# EAGLE design badge_03v5 (EAGLE 8.3.2)
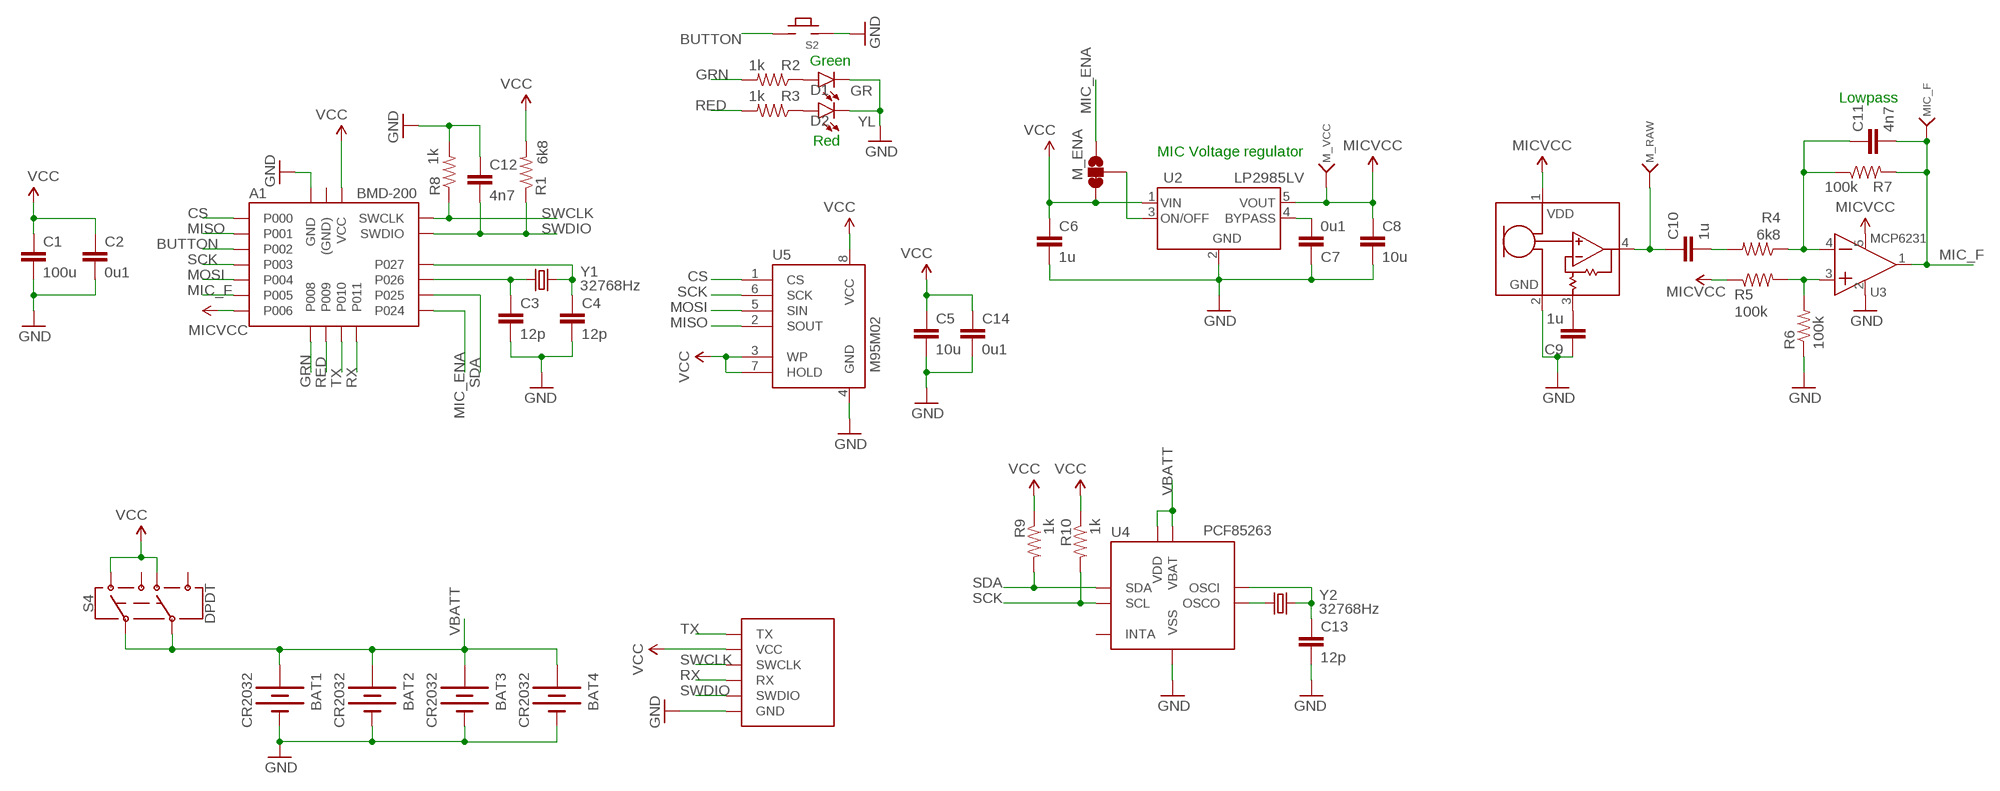
[diagram p0: schematic, sheet 1]

## Parts
A1  BMD-200  [BMD-200]
BAT1  CR2032  BATTERY20MM_ISO_NOCREAM  [BATTCON_20MM_4LEGS_ISO_NOCREAM]
BAT2  CR2032  BATTERY20MM_ISO_NOCREAM  [BATTCON_20MM_4LEGS_ISO_NOCREAM]
BAT3  CR2032  BATTERYHOLDER  [BU2032SM]
BAT4  CR2032  BATTERYBU2032SM_CREAM  [BU2032SM_CREAM]
C1  100u  C-EUC1206  [C1206]
C2  0u1  C-EUC0603  [C0603]
C3  12p  C-EUC0603  [C0603]
C4  12p  C-EUC0603  [C0603]
C5  10u  C-EUC0603  [C0603]
C6  1u  C-EUC0603  [C0603]
C7  0u1  C-EUC0603  [C0603]
C8  10u  C-EUC0603  [C0603]
C9  1u  C-EUC0603  [C0603]
C10  1u  C-EUC0603  [C0603]
C11  4n7  C-EUC0603  [C0603]
C12  4n7  C-EUC0603  [C0603]
C13  12p  C-EUC0603  [C0603]
C14  0u1  C-EUC0603  [C0603]
D1  GR  LED  [LED-0603]
D2  YL  LED  [LED-0603]
J1  PROG_CONN_6  [TH_CONN_6]
M_ENA  JUMPER-PAD-3-2OF3_NC_BY_TRACE_SMALL  [PAD-JUMPER-3-2OF3_NC_BY_TRACE_YES_SILK_FULL_BOX]
M_RAW  TESTPOINT  [TESTPOINT]
M_VCC  TESTPOINT  [TESTPOINT]
MIC_F  TESTPOINT  [TESTPOINT]
MK1  SPU0414  SPU0414(AMP)  [MIC_SPU041X]
R1  6k8  R-US_R0603  [R0603]
R2  1k  R-US_R0603  [R0603]
R3  1k  R-US_R0603  [R0603]
R4  6k8  R-US_R0603  [R0603]
R5  100k  R-US_R0603  [R0603]
R6  100k  R-US_R0603  [R0603]
R7  100k  R-US_R0603  [R0603]
R8  1k  R-US_R0603  [R0603]
R9  1k  R-US_R0603  [R0603]
R10  1k  R-US_R0603  [R0603]
S2  TACT6mm  TACT6MM4  [TACT1]
S4  DPDT  SWITCH-DPDT-SMD-AYZ0202  [SWITCH_DPDT_SMD_AYZ0202]
U2  LP2985LV  [SOT23-5L]
U3  MCP6231  [SOT23-5L]
U4  PCF85263  [SOIC8]
U5  M95M02  M95M02_SOIC  [SOIC8]
Y1  32768Hz  CRYSTAL  [CRYSTAL_2SMD]
Y2  32768Hz  CRYSTAL  [CRYSTAL_2SMD]

## Nets
BUTTON: A1.P$13(P002) S2.1 S2.2
CS: A1.P$11(P000) U5.1(CS)
GND: A1.P$1(GND) A1.P$2(GND) A1.P$3(GND) A1.P$4(GND) A1.P$7(GND) A1.P$10(GND) A1.P$19(GND) A1.P$26(GND) BAT1.NEG(-) BAT2.NEG(-) BAT3.- BAT4.- C1.2 C2.2 C3.2 C4.2 C5.2 C6.2 C7.1 C8.2 C9.1 C12.1 C13.2 C14.2 D1.C D2.C J1.GND MK1.2(GND) R6.1 R8.2 S2.3 S2.4 U2.2(GND) U3.2(GND) U4.4(VSS) U5.4(GND)
GRN: A1.P$20(P008) R2.2
MIC_ENA: A1.P$5(P024) M_ENA.1
MIC_F: A1.P$16(P005) C11.2 MIC_F.P$1(>NAME) R7.2 U3.1(O)
MICVCC: A1.P$17(P006) C8.1 M_VCC.P$1(>NAME) MK1.1(VDD) R5.1 U2.5(VOUT) U3.5(VDD)
MISO: A1.P$12(P001) U5.2(SOUT)
MOSI: A1.P$15(P004) U5.5(SIN)
N$1: U4.2(OSCO) Y2.P$2
N$2: A1.P$8(P026) C3.1 Y1.P$2
N$3: D1.A R2.1
N$4: D2.A R3.1
N$5: C13.1 U4.1(OSCI) Y2.P$1
N$6: M_ENA.2 U2.3(ON/OFF)
N$7: C9.2 MK1.3(GAIN)
N$8: A1.P$9(P027) C4.1 Y1.P$1
N$9: C7.2 U2.4(BYPASS)
N$10: R5.2 R6.2 U3.3(+)
N$11: C10.1 M_RAW.P$1(>NAME) MK1.4(OUT)
N$13: C10.2 R4.2
N$14: C11.1 R4.1 R7.1 U3.4(-)
RED: A1.P$21(P009) R3.2
RX: A1.P$23(P011) J1.RX
SCK: A1.P$14(P003) R10.2 U4.6(SCL) U5.6(SCK)
SDA: A1.P$6(P025) R9.2 U4.5(SDA)
SWCLK: A1.P$25(SWCLK) J1.SWCLK R8.1
SWDIO: A1.P$24(SWDIO) C12.2 J1.SWDIO R1.1
TX: A1.P$22(P010) J1.TX
VBATT: BAT1.1(+) BAT1.2(+) BAT1.3(+) BAT1.4(+) BAT2.1(+) BAT2.2(+) BAT2.3(+) BAT2.4(+) BAT3.+ BAT4.+ S4.2 S4.5 U4.3(VBAT) U4.8(VDD)
VCC: A1.P$18(VCC) C1.1 C2.1 C5.1 C6.1 C14.1 J1.VCC M_ENA.3 R1.2 R9.1 R10.1 S4.1 S4.4 U2.1(VIN) U5.3(WP) U5.7(HOLD) U5.8(VCC)
Unconnected: A1.P$27((GND)) A1.P$28((GND)) S4.3 S4.6 U4.7(INTA)

## Notes on the sheet
- Green
- Lowpass
- Red
- MIC Voltage regulator

## Library data of the parts
A1 = rigado_BMD-200:BMD-200
BAT1-BAT4 = Badge:BATTERY: Battery Holders Various common sizes : AA, AAA, 18650 (PRT-12895), 20mm coin cell and 12mm coin cell. 20MM_4LEGS, BATT-10373
C1-C14 = rcl:C-EU: CAPACITOR, European symbol
D1 D2 = Badge:LED
J1 = Badge:PROG_CONN_6
M_ENA = Badge:JUMPER-PAD-3-2OF3_NC_BY_TRACE
M_RAW M_VCC MIC_F = Badge:TESTPOINT
MK1 = Badge:SPU0414(AMP)
R1-R10 = rcl:R-US_: RESISTOR, American symbol
S2 = Badge:TACT
S4 = Badge:SWITCH-DPDT: Double-Pole, Double-Throw (DPDT) Switch Double-pole, double-throw switches. Variant Overview PTH-GPI-152-3013 Used on SparkFun Geiger Counter <https://www.sparkfun.com/products/11345> SMD-AY0202 Surface Mount DPDT Switch <https://www.sparkfun.com/products/597> (COM-00597) Used on e.g. LilyPad Arduino USB - ATmega32U4 Board <https://www.sparkfun.com/products/12049>; PROD_ID: SWCH-08179; SF_SKU: COM-00597
U2 = Badge:LP2985LV
U3 = Badge:MCP6231
U4 = Badge:PCF85263
U5 = Badge:M95M02
Y1 Y2 = Badge:CRYSTAL

## Board
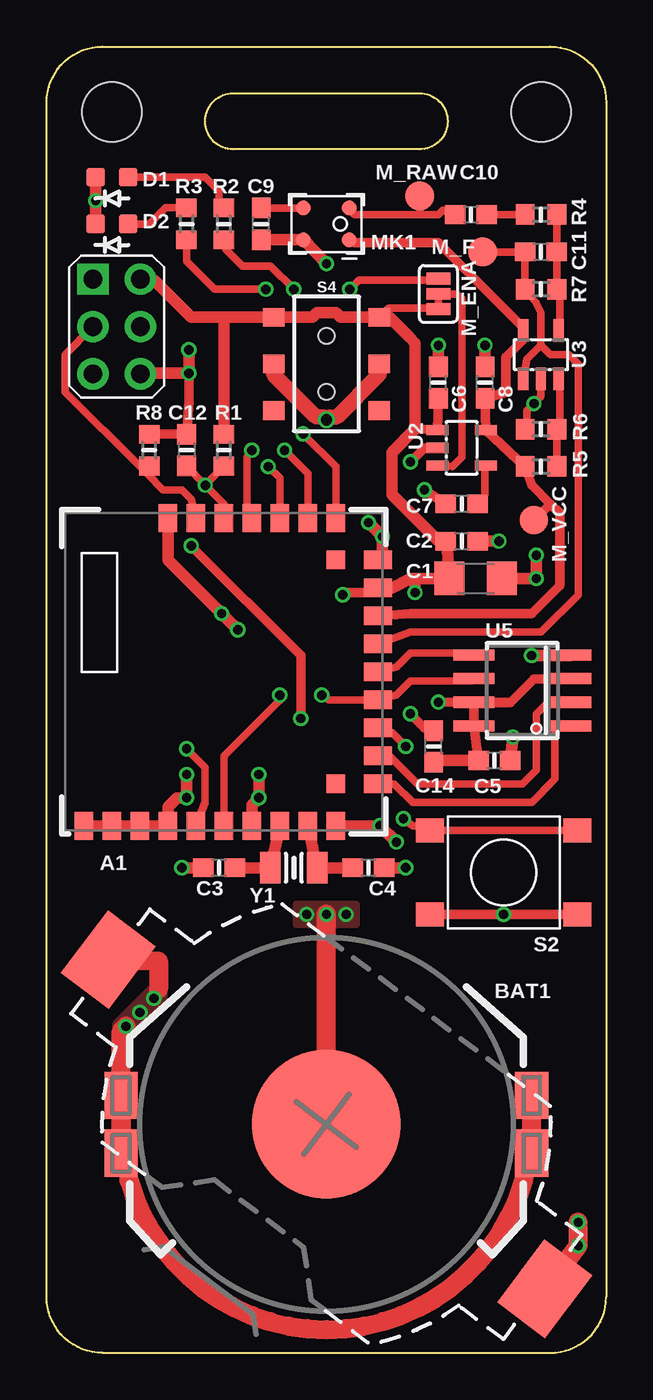
[diagram p1: board, top side]
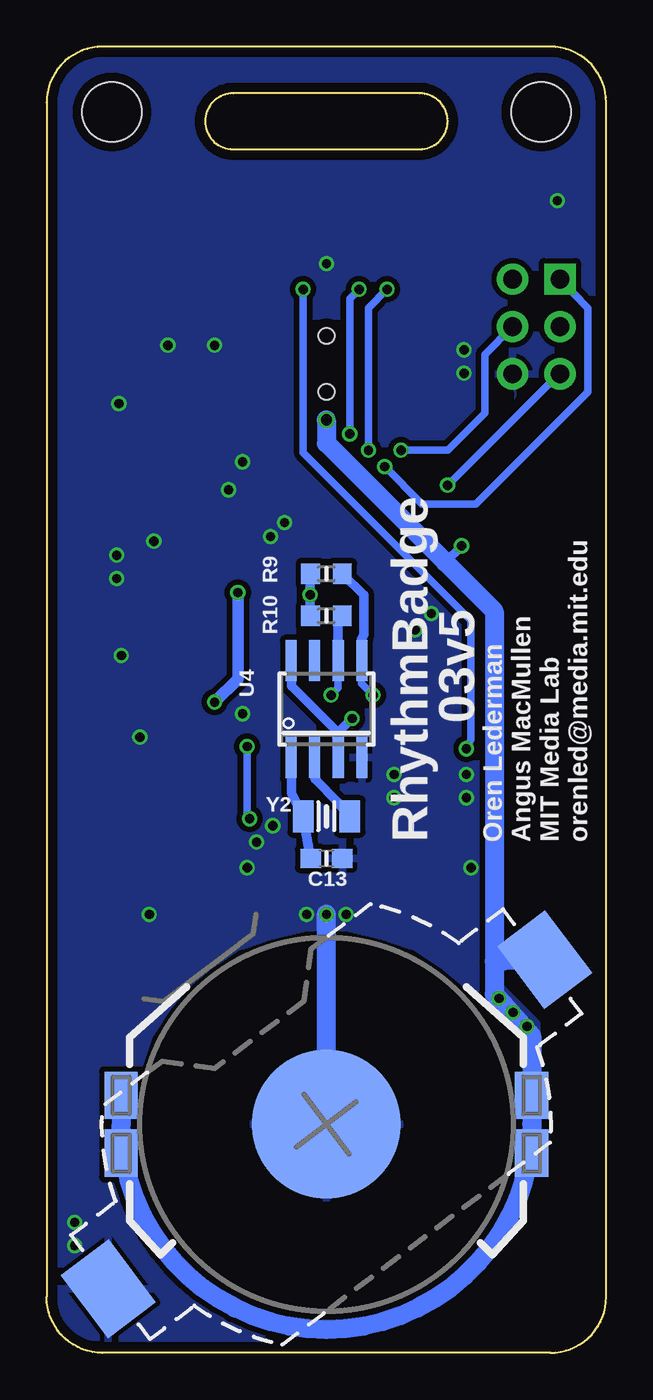
[diagram p2: board, bottom side, seen from below]

Size 30 x 70 mm. Coordinates in mm from the lower left corner, seen from the top.
Outline: 3,0 27,0 arc90 30,3 30,67 arc90 27,70 3,70 arc90 0,67 0,3 arc90 3,0
Outline: 10,67.5 20,67.5 arc-90 21.5,66 arc-90 20,64.5 10,64.5 arc-90 8.5,66 arc-90 10,67.5
Copper layers (1*16): Top 0.035mm / dielectric 1.5mm / Bottom 0.035mm
Design rules "ITEADstudio_DRC - oren *": minimum track width 6mil, minimum drill 12mil, track to track 6mil, track to pad 6mil, pad to pad 6mil, via to via 6mil, smd to smd 0mil, copper to edge 20mil, drill to drill 20mil, minimum pad ring 10mil, minimum via ring 6mil, stop-mask expansion 2mil, vias tented up to drill 100mil, thermal gap 10mil
Holes 3.2 mm at 3.5,66.5 26.5,66.5
bRestrict: area 5.2,50.1 to 6.2,51.5

### Footprints (pad centres in the part's own frame; a part is rotated, then mirrored left to right if it is on the bottom)
BMD-200 = smd 1.5 x 1: P$1 -8.25,7.5; P$2 -8.25,6; P$3 -8.25,4.5; P$4 -8.25,3; P$5 -8.25,1.5; P$6 -8.25,0; P$7 -8.25,-1.5; P$8 -8.25,-3; P$9 -8.25,-4.5; P$10 -8.25,-6; P$20 8.25,-6; P$21 8.25,-4.5; P$22 8.25,-3; P$23 8.25,-1.5; P$24 8.25,0; P$25 8.25,1.5; P$26 8.25,3 | smd 1 x 1.5: P$11 -6,-8.25; P$12 -4.5,-8.25; P$13 -3,-8.25; P$14 -1.5,-8.25; P$15 0,-8.25; P$16 1.5,-8.25; P$17 3,-8.25; P$18 4.5,-8.25; P$19 6,-8.25 | smd 1 x 1: P$27 -6,-6; P$28 6,-6
BATTCON_20MM_4LEGS_ISO_NOCREAM = smd 1.778 x 2.54: 1 -11,1.55; 2 -11,-1.55; 3 11,1.55; 4 11,-1.55 | smd 8 x 8: NEG 0,0
BU2032SM = smd 3.2 x 4.2: + -14.65,0; - 14.65,0
BU2032SM_CREAM = smd 3.2 x 4.2: + -14.65,0; - 14.65,0
C1206 = smd 1.6 x 1.8: 1 -1.4,0; 2 1.4,0
C0603 = smd 1.1 x 1: 1 -0.85,0; 2 0.85,0
LED-0603 = smd 1 x 1: A 0.877,0; C -0.877,0
TH_CONN_6 = drill 1 pad 1.676: GND 1.27,-2.54; RX 1.27,0; SWCLK -1.27,0; SWDIO -1.27,-2.54; VCC 1.27,2.54 | drill 1 pad 1.676 square: TX -1.27,2.54
PAD-JUMPER-3-2OF3_NC_BY_TRACE_YES_SILK_FULL_BOX = smd 0.635 x 1.27: 1 -0.813,0; 2 0,0; 3 0.813,0
TESTPOINT = smd 1.524 x 1.524: P$1 0,0
MIC_SPU041X = smd 0.8 x 0.8: 1 -1.23,0.85; 2 1.23,0.85; 3 1.23,-0.85; 4 -1.23,-0.85
R0603 = smd 1 x 1.1: 1 -0.85,0; 2 0.85,0
TACT1 = smd 1.5 x 1.3: 1 -3.95,2.25; 2 3.95,2.25; 3 -3.95,-2.25; 4 3.95,-2.25
SWITCH_DPDT_SMD_AYZ0202 = smd 1 x 1.15: 1 -2.5,2.825; 2 0,2.825; 3 2.5,2.825; 4 -2.5,-2.825; 5 0,-2.825; 6 2.5,-2.825 | hole 0.85: 1.5,0; -1.5,0
SOT23-5L = smd 1.2 x 0.55: 1 -1.3,0.95; 2 -1.3,0; 3 -1.3,-0.95; 4 1.3,-0.95; 5 1.3,0.95
SOIC8 = smd 2.2 x 0.6: 1 -2.6,1.905; 2 -2.6,0.635; 3 -2.6,-0.635; 4 -2.6,-1.905; 5 2.6,-1.905; 6 2.6,-0.635; 7 2.6,0.635; 8 2.6,1.905
CRYSTAL_2SMD = smd 1.1 x 1.7: P$1 -1.25,0; P$2 1.25,0

### Placement (x,y rotation side)
A1  9.5,36.5 90 top
BAT1  15,12.25 0 top
BAT2  15,12.25 0 bottom
BAT3  15,12.25 217 bottom
BAT4  15,12.25 323 top
C1  23,41.5 0 top
C2  22.25,43.5 0 top
C3  9.25,26 180 top
C4  17.25,26 0 top
C5  24,31.75 0 top
C6  21,52 90 top
C7  22.25,45.5 0 top
C8  23.5,52 90 top
C9  11.5,60.5 90 top
C10  22.75,61 0 top
C11  26.5,59 180 top
C12  7.5,48.38 270 top
C13  15,26.5 0 bottom
C14  20.75,32.5 90 top
D1  3.5,63 0 top
D2  3.5,60.5 0 top
J1  3.75,55 0 top
M_ENA  21,56.75 270 top
M_RAW  20,62 0 top
M_VCC  26.12,44.62 0 top
MIC_F  23.38,59 0 top
MK1  15,60.5 180 top
R1  9.5,48.38 90 top
R2  9.5,60.5 270 top
R3  7.5,60.5 270 top
R4  26.5,61 180 top
R5  26.5,47.5 0 top
R6  26.5,49.5 0 top
R7  26.5,57 180 top
R8  5.5,48.38 90 top
R9  15,41.75 0 bottom
R10  15,39.5 0 bottom
S2  24.5,25.75 0 top
S4  15,53 270 top
U2  22.25,48.5 0 top
U3  26.5,53.5 90 top
U4  15,34.5 90 bottom
U5  25.5,35.5 180 top
Y1  13.25,26 180 top
Y2  15,28.75 0 bottom

### Tracks (layer width: path | path; a pad name or v marks a point on that pad's centre or on a via)
BUTTON  (via drill 0.5)
  Top 0.406: S2.2 S2.1 20.25,28.25 19.62,28.25 v19.12,28.62 | v19.25,32.5 18.5,33.25 A1.P$13
  Bottom 0.406: v19.12,28.62 19.25,29 v19.25,32.5
CS
  Top 0.406: A1.P$11 18.62,30.5 19.62,29.5 26,29.5 27.25,30.75 27.25,33.25 27.59,33.59 U5.1
GND  (via drill 0.5)
  Top 0.406: A1.P$19 18,43 | U3.2 26.5,51.25 v26.12,50.88 25.75,50.5 25.75,50 R6.1
  Top 0.508: S2.4 v24.5,23.5 S2.3 | U2.2 20.25,48.5 v19.5,47.75 | C7.1 v20.25,46.25 | C14.2 20.25,33.5 v19.5,34.25 | v7.62,52.5 7.62,51 C12.1 R8.2
  Top 0.61: C3.2 v7.25,26 | A1.P$7 11,29.38 v11.38,29.75 v11.38,31 | C4.2 v19.25,26 | A1.P$1 A1.P$2 A1.P$3 A1.P$4 6.5,29.25 7,29.75 v7.5,29.75 v7.5,31 | 18,43 v18,43.75 v17.25,44.5 | A1.P$26 6.5,42.5 v9.38,39.62 v10.25,38.75 | v15,58.38 MK1.2 C9.1 | D1.C v2.62,61.75 | v2.62,61.75 D2.C | v2.62,61.75 | A1.P$10 v17.88,28.25 v18.75,27.38 | C6.2 v21,54 | C8.2 v23.5,54 | C1.2 v26.25,41.5 v26.25,42.75 | C2.2 v24.25,43.5 | C5.2 v25,33 | v7.62,53.75 v7.62,52.5 5.5,52.5 J1.GND | U5.4 28.1,37.38 v26,37.38
  Top 1.016: BAT2.NEG v15,23.5 | BAT4.- v28.5,5.75 v28.5,7
  Bottom 1.016: BAT2.NEG v15,23.5
  other vias: 16.06,23.5 13.94,23.5
  pour Bottom (isolate 0.3, rank 2): 30,0 30,67 arc90 27,70 3,70 arc90 0,67 0,0
  pour Top: 13.41,22.97 13.41,24.03 16.59,24.03 16.59,22.97
GRN  (via drill 0.5)
  Top 0.406: v13.25,57 12,58.25 10.5,58.25 9.62,59.12 R2.2 | A1.P$20 15.5,47.5 v13.75,49.25
  Bottom 0.406: v13.75,49.25 13.75,56.5 v13.25,57
MIC_ENA  (via drill 0.5)
  Top 0.406: v7.5,32.38 8.5,31.38 8.5,29.5 A1.P$5 | v16.25,57 16.75,57.5 20.25,57.5 M_ENA.1
  Bottom 0.406: v16.25,57 16.25,48.25 7.25,39.25 7.25,32.88 v7.5,32.38
MIC_F
  Top 0.406: A1.P$16 19.5,38.62 26.5,38.62 28.5,40.62 28.5,53 28,53.5 27,53.5 26.5,54 | 26.5,54 26.5,55.75 26.25,56.25 R7.2 C11.2 MIC_F.P$1 | 26.5,54 25.75,53.25 U3.1
MICVCC
  Top 0.508: MK1.1 16.5,59.5 21,59.5 25.5,55 U3.5 25.5,54.25 24.62,53.38 24.62,51.5 C8.1 U2.5 R5.1 26,46.5 27,45.5 | A1.P$17 19.5,39.62 26,39.62 27.5,41.12 27.5,45 27,45.5 | M_VCC.P$1 27,45.5
MISO
  Top 0.406: 26.56,34.56 26.25,34.25 26.25,31.25 25.5,30.5 19.88,30.5 18.38,32 A1.P$12 | 26.56,34.56 26.75,34.75 | 26.56,34.56 26.86,34.87 U5.2
MOSI
  Top 0.406: A1.P$15 18.75,36.75 19.5,37.5 21.5,37.5 | 21.5,37.5 21.75,37.5 | 21.5,37.5 22.8,37.5 U5.5
N$1
  Bottom 0.508: Y2.P$2 14.38,29.5 15.62,30.75 U4.2
N$2
  Top 0.61: A1.P$8 Y1.P$2 C3.1
N$3
  Top 0.406: R2.1 9.25,61.88 9.25,62.25 8.5,63 D1.A
N$4
  Top 0.406: D2.A 5.5,60.5 6.38,61.38 6.88,61.38 R3.1
N$5
  Bottom 0.508: C13.1 Y2.P$1 16.88,30 16.88,30.88 U4.1
N$6
  Top 0.406: U2.3 21.75,47.5 22.25,48 22.25,56.5 22,56.75 M_ENA.2
N$7
  Top 0.406: MK1.3 C9.2
N$8
  Top 0.61: A1.P$9 Y1.P$1 C4.1
N$9
  Top 0.406: U2.4 23.5,47.25 23.5,46 C7.2
N$10
  Top 0.406: U3.3 27.5,51.5 27.5,50 R6.2 R5.2
N$11
  Top 0.406: MK1.4 16.5,61 20,61 | 20,61 21,61 21.25,61.25 C10.1 | M_RAW.P$1 20,61
N$13
  Top 0.406: C10.2 R4.2
N$14
  Top 0.406: R4.1 C11.1 R7.1 27.5,56.5 27.5,55 U3.4
RED  (via drill 0.5)
  Top 0.406: A1.P$21 14,47.12 v12.75,48.38 | v11.75,57 9,57 7.5,58.5 R3.2
  Bottom 0.406: v12.75,48.38 12.75,56 v11.75,57
RX  (via drill 0.5)
  Top 0.406: v11,48.38 10.75,48 10.75,45.12 A1.P$23
  Bottom 0.406: J1.RX 6.5,53.5 6.5,50.38 8.5,48.38 v11,48.38
SCK  (via drill 0.5)
  Top 0.406: v14.75,35.25 15.12,35 A1.P$14 18.75,35.25 19.5,36 22.77,36 U5.6
  Bottom 0.406: 14.38,38.12 U4.6 14.38,35.62 v14.75,35.25
  Bottom 0.508: 14.38,38.12 14.38,39 R10.2
SDA  (via drill 0.5)
  Top 0.406: A1.P$6 9.5,32 12.5,35 v12.5,35.25
  Bottom 0.406: 13.12,38.25 U4.5 13.12,35.88 v12.5,35.25
  Bottom 0.508: 13.12,38.25 13,38.5 13,40.62 R9.2
SWCLK
  Top 0.406: J1.SWCLK 1,53.5 1,51.5 5,47.5 R8.1 5.38,47.12 6.25,46.25 7.25,46.25 7.75,45.75 A1.P$25
SWDIO  (via drill 0.5)
  Top 0.406: v8.5,46.5 9.5,45.5 A1.P$24 | v8.5,46.5 R1.1 | C12.2 v8.5,46.5
  Bottom 0.406: J1.SWDIO 2.88,52.12 v8.5,46.5
TX  (via drill 0.5)
  Top 0.406: v11.88,47.5 12.5,46.88 A1.P$22
  Bottom 0.406: J1.TX 1,56 1,51.5 7,45.5 9.88,45.5 v11.88,47.5
VBATT  (via drill 0.5, 0.6)
  Top 0.508: v13.62,34 13.62,37.38 v7.75,43.25
  Top 0.813: S4.2 17.82,52.43 15.55,50.16 15.16,50.16 v15,50 14.84,50.16 14.45,50.16 12.18,52.43 S4.5
  Top 1.016: BAT2.3 4,12.25 arc90 15,1.25 arc90 26,12.25 | 26,12.25 BAT2.1 | BAT2.2 26,12.25 | BAT2.3 4,17.25 | 4,17.25 arc90 v4.25,17.5 4,17.25 | BAT2.4 BAT2.3 | BAT4.+ 6,21 6,19.5
  Bottom 0.406: 14.38,32.25 U4.3
  Bottom 0.508: 14.38,32.25 14.38,33.25 | 14.38,33.25 v13.62,34 | v7.75,43.25 8.62,42.38 | U4.8 16.88,35.75 14.38,33.25
  Bottom 0.813: 6,21.07 6,21
  Bottom 1.016: v15,50 15,48.75 8.62,42.38 6,39.75 6,21 | 6,21 6,19.25 4,17 BAT2.3 4,12.25 | 4,12.25 arc90 15,1.25 arc90 26,12.25 | BAT2.1 26,12.25 | BAT2.2 26,12.25 | 4,12.25 BAT2.4 | 6,21 5.5,21 | BAT4.+ 5.75,21.01 | BAT4.+ | BAT4.+ 6,21
  other vias: 5,18.25 5.75,19
  pour Bottom (isolate 0.254): 4,17 4,17.5 6,19.5 6,19
  pour Top: 4,17 4,17.5 6,19.5 6,19
VCC  (via drill 0.5)
  Top 0.406: M_ENA.3 20.5,56 18.32,56 S4.1
  Top 0.508: C6.1 U2.1 19.75,49.5 | A1.P$18 17,40.75 16.12,40.75 v15.88,40.62 15.85,40.75 | C5.1 U5.8 U5.7 | U5.7 v21,34.88 | U5.7 24.86,34.87 26.12,36.12 U5.3
  Top 0.61: J1.VCC 5.75,57.5 7.75,55.5 9.5,55.5 | A1.P$18 18.5,41 19.5,41.5 19.75,41.5 | 19.75,41.5 C1.1 21.5,41.5 21.5,42.75 C2.1 21,43.5 18.5,46 18.5,48.25 19.75,49.5 19.75,54.12 19.44,54.44 | v19.75,40.75 19.75,41.5 | C5.1 21.12,31.75 C14.1 | R1.2 9.5,55.5 | 19.44,54.44 18.38,55.5 | 9.5,55.5 S4.4 14.25,55.5 14.49,55.74 15.51,55.74 15.75,55.5 S4.1 18.38,55.5 | 18.38,55.5 19.44,54.44
  Bottom 0.508: R10.1 v15.88,40.62 R9.1
  Bottom 0.61: v21,34.88 19.75,36.12 v19.75,40.75

### Text on the board
bPlace: 03v5 | Oren Lederman / Angus MacMullen / MIT Media Lab / orenled@media.mit.edu | RhythmBadge
tNames: M_RAW | M_F | M_VCC
tValues: TX | VCC | ON | RX | GND | SWDIO | OFF
bValues: TX | VCC | CLK | RX | IO | GND